# Altium schematic sheet TranslationDir2Chan.SchDoc: 2-Channel Directional Translation
size Letter; Engineer: Nathan Petersen; DocumentNumber: 15; Revision: v1.2; SheetNumber: 15; SheetTotal: 23
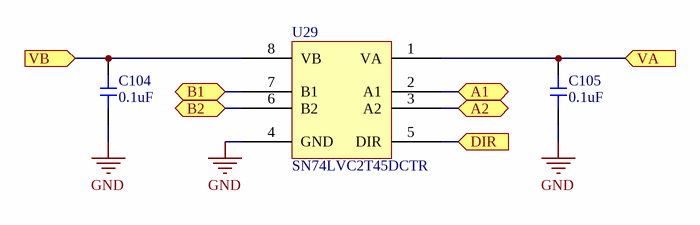
[diagram p0: TranslationDir2Chan.SchDoc]

## Parts
C104  value 0.1uF  [0603-CAP]  (hidden comment: Capacitor)
C105  value 0.1uF  [0603-CAP]  (hidden comment: Capacitor)
U29  SN74LVC2T45DCTR  [TSOP65P400X130-8N]

## Ports
A1 (bidir), A2 (bidir), B1 (bidir), B2 (bidir), DIR (in), VA (in), VB (in)

## Nets
GND: C104.2 C105.2 U29.4(GND)
A1: U29.2(A1) ; port A1
A2: U29.3(A2) ; port A2
B1: U29.7(B1) ; port B1
B2: U29.6(B2) ; port B2
DIR: U29.5(DIR) ; port DIR
VA: C105.1 U29.1(VA) ; port VA
VB: C104.1 U29.8(VB) ; port VB

## Notes on the sheet
- Title:
- File:
- Sheet:
- of
- Revision:
- Time:
- Date:
- Engineer:

## Library data of the parts
U29 = SN74LVC2T45DCTR: IC BUS TRANSCVR 2BIT N-INV SM8; Supplier 1: Digi-Key; Supplier Part Number 1: 296-16845-1-ND
C104 C105 = Capacitor: Supplier 1: Digi-Key; Supplier Part Number 1: 1276-1012-6-ND